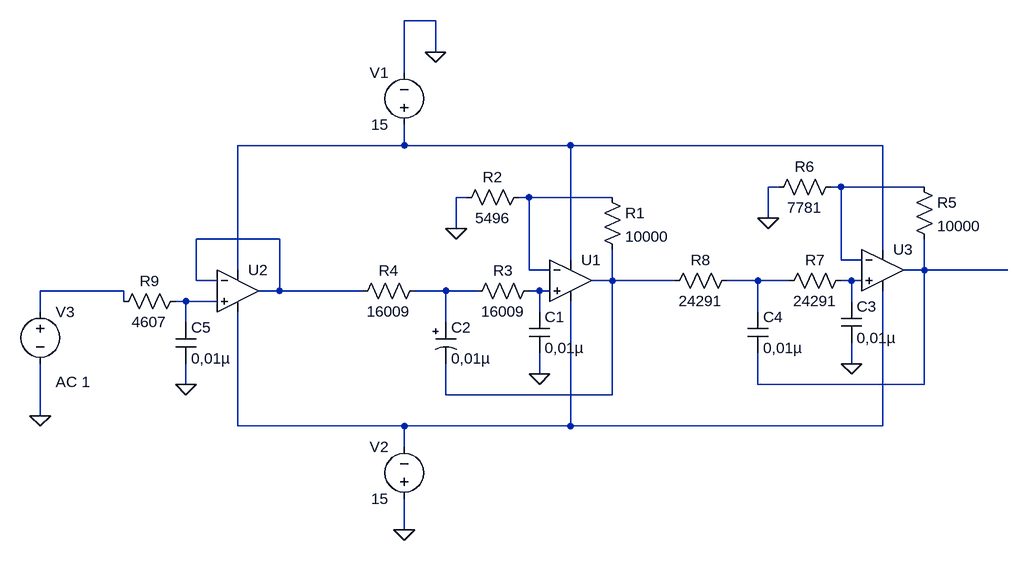
[diagram p0: schematic Draft3.asc]
Draft3.asc, the LTspice schematic file:
Version 4
SHEET 1 1556 948
WIRE -544 -448 -592 -448
WIRE -544 -400 -544 -448
WIRE -592 -368 -592 -448
WIRE -592 -256 -592 -288
WIRE -592 -256 -848 -256
WIRE -336 -256 -592 -256
WIRE 144 -256 -336 -256
WIRE -16 -192 -32 -192
WIRE 80 -192 64 -192
WIRE 208 -192 80 -192
WIRE -496 -176 -512 -176
WIRE -400 -176 -416 -176
WIRE -272 -176 -400 -176
WIRE -32 -144 -32 -192
WIRE -512 -128 -512 -176
WIRE -784 -112 -912 -112
WIRE 144 -96 144 -256
WIRE -336 -80 -336 -256
WIRE 80 -80 80 -192
WIRE 112 -80 80 -80
WIRE -848 -64 -848 -256
WIRE -400 -64 -400 -176
WIRE -368 -64 -400 -64
WIRE 208 -64 208 -112
WIRE 208 -64 176 -64
WIRE 336 -64 208 -64
WIRE -912 -48 -912 -112
WIRE -880 -48 -912 -48
WIRE -272 -48 -272 -96
WIRE -272 -48 -304 -48
WIRE -176 -48 -272 -48
WIRE -48 -48 -96 -48
WIRE 0 -48 -48 -48
WIRE 96 -48 80 -48
WIRE 112 -48 96 -48
WIRE -1024 -32 -1152 -32
WIRE -784 -32 -784 -112
WIRE -784 -32 -816 -32
WIRE -656 -32 -784 -32
WIRE -528 -32 -576 -32
WIRE -480 -32 -528 -32
WIRE -384 -32 -400 -32
WIRE -368 -32 -384 -32
WIRE -1024 -16 -1024 -32
WIRE -928 -16 -944 -16
WIRE -880 -16 -928 -16
WIRE 96 -16 96 -48
WIRE -1152 0 -1152 -32
WIRE -384 0 -384 -32
WIRE -48 0 -48 -48
WIRE -928 16 -928 -16
WIRE -528 16 -528 -32
WIRE 96 80 96 48
WIRE -384 96 -384 64
WIRE -928 112 -928 80
WIRE -48 112 -48 64
WIRE 208 112 208 -64
WIRE 208 112 -48 112
WIRE -528 128 -528 80
WIRE -272 128 -272 -48
WIRE -272 128 -528 128
WIRE -1152 160 -1152 80
WIRE -848 176 -848 0
WIRE -592 176 -848 176
WIRE -336 176 -336 -16
WIRE -336 176 -592 176
WIRE 144 176 144 -32
WIRE 144 176 -336 176
WIRE -592 208 -592 176
WIRE -592 336 -592 288
FLAG -544 -400 0
FLAG -384 96 0
FLAG -512 -128 0
FLAG -592 336 0
FLAG 96 80 0
FLAG -32 -144 0
FLAG -928 112 0
FLAG -1152 160 0
SYMBOL Opamps\\UniversalOpamp2 -336 -48 R0
SYMATTR InstName U1
SYMBOL res -288 -192 R0
SYMATTR InstName R1
SYMATTR Value 10000
SYMBOL res -512 -160 R270
WINDOW 0 32 56 VTop 2
WINDOW 3 0 56 VBottom 2
SYMATTR InstName R2
SYMATTR Value 5496
SYMBOL voltage -592 -272 R180
WINDOW 0 24 96 Left 2
WINDOW 3 24 16 Left 2
WINDOW 123 0 0 Left 2
WINDOW 39 0 0 Left 2
SYMATTR InstName V1
SYMATTR Value 15
SYMBOL voltage -592 304 R180
WINDOW 0 24 96 Left 2
WINDOW 3 24 16 Left 2
WINDOW 123 0 0 Left 2
WINDOW 39 0 0 Left 2
SYMATTR InstName V2
SYMATTR Value 15
SYMBOL cap -400 0 R0
SYMATTR InstName C1
SYMATTR Value 0,01µ
SYMBOL polcap -544 16 R0
WINDOW 3 24 56 Left 2
SYMATTR InstName C2
SYMATTR Value 0,01µ
SYMATTR Description Capacitor
SYMATTR Type cap
SYMBOL res -384 -48 R90
WINDOW 0 0 56 VBottom 2
WINDOW 3 32 56 VTop 2
SYMATTR InstName R3
SYMATTR Value 16009
SYMBOL res -560 -48 R90
WINDOW 0 0 56 VBottom 2
WINDOW 3 32 56 VTop 2
SYMATTR InstName R4
SYMATTR Value 16009
SYMBOL Opamps\\UniversalOpamp2 -848 -32 R0
SYMATTR InstName U2
SYMBOL Opamps\\UniversalOpamp2 144 -64 R0
SYMATTR InstName U3
SYMBOL res 192 -208 R0
SYMATTR InstName R5
SYMATTR Value 10000
SYMBOL res -32 -176 R270
WINDOW 0 32 56 VTop 2
WINDOW 3 0 56 VBottom 2
SYMATTR InstName R6
SYMATTR Value 7781
SYMBOL cap 80 -16 R0
SYMATTR InstName C3
SYMATTR Value 0,01µ
SYMBOL cap -64 0 R0
SYMATTR InstName C4
SYMATTR Value 0,01µ
SYMBOL res 96 -64 R90
WINDOW 0 0 56 VBottom 2
WINDOW 3 32 56 VTop 2
SYMATTR InstName R7
SYMATTR Value 24291
SYMBOL res -80 -64 R90
WINDOW 0 0 56 VBottom 2
WINDOW 3 32 56 VTop 2
SYMATTR InstName R8
SYMATTR Value 24291
SYMBOL res -928 -32 R90
WINDOW 0 0 56 VBottom 2
WINDOW 3 32 56 VTop 2
SYMATTR InstName R9
SYMATTR Value 4607
SYMBOL cap -944 16 R0
SYMATTR InstName C5
SYMATTR Value 0,01µ
SYMBOL voltage -1152 -16 R0
WINDOW 123 24 124 Left 2
WINDOW 39 0 0 Left 2
SYMATTR InstName V3
SYMATTR Value ""
SYMATTR Value2 AC 1

The netlist it stands for:
* Draft3.asc
XU1 N011 N003 N001 N013 N006 level.2 Avol=1Meg GBW=10Meg Slew=10Meg ilimit=25m rail=0 Vos=0 phimargin=45 en=0 enk=0 in=0 ink=0 Rin=500Meg  ; pins IN+ IN- V+ V- OUT
R1 N003 N006 10000
R2 0 N003 5496
V1 N001 0 15
V2 0 N013 15
C1 N011 0 0,01µ
C2 N010 N006 0,01µ
R3 N011 N010 16009
R4 N010 N004 16009
XU2 N012 N004 N001 N013 N004 level.2 Avol=1Meg GBW=10Meg Slew=10Meg ilimit=25m rail=0 Vos=0 phimargin=45 en=0 enk=0 in=0 ink=0 Rin=500Meg  ; pins IN+ IN- V+ V- OUT
XU3 N008 N002 N001 N013 N005 level.2 Avol=1Meg GBW=10Meg Slew=10Meg ilimit=25m rail=0 Vos=0 phimargin=45 en=0 enk=0 in=0 ink=0 Rin=500Meg  ; pins IN+ IN- V+ V- OUT
R5 N002 N005 10000
R6 0 N002 7781
C3 N008 0 0,01µ
C4 N007 N005 0,01µ
R7 N008 N007 24291
R8 N007 N006 24291
R9 N012 N009 4607
C5 N012 0 0,01µ
V3 N009 0 AC 1
.lib UniversalOpamps2.sub
.backanno
.end